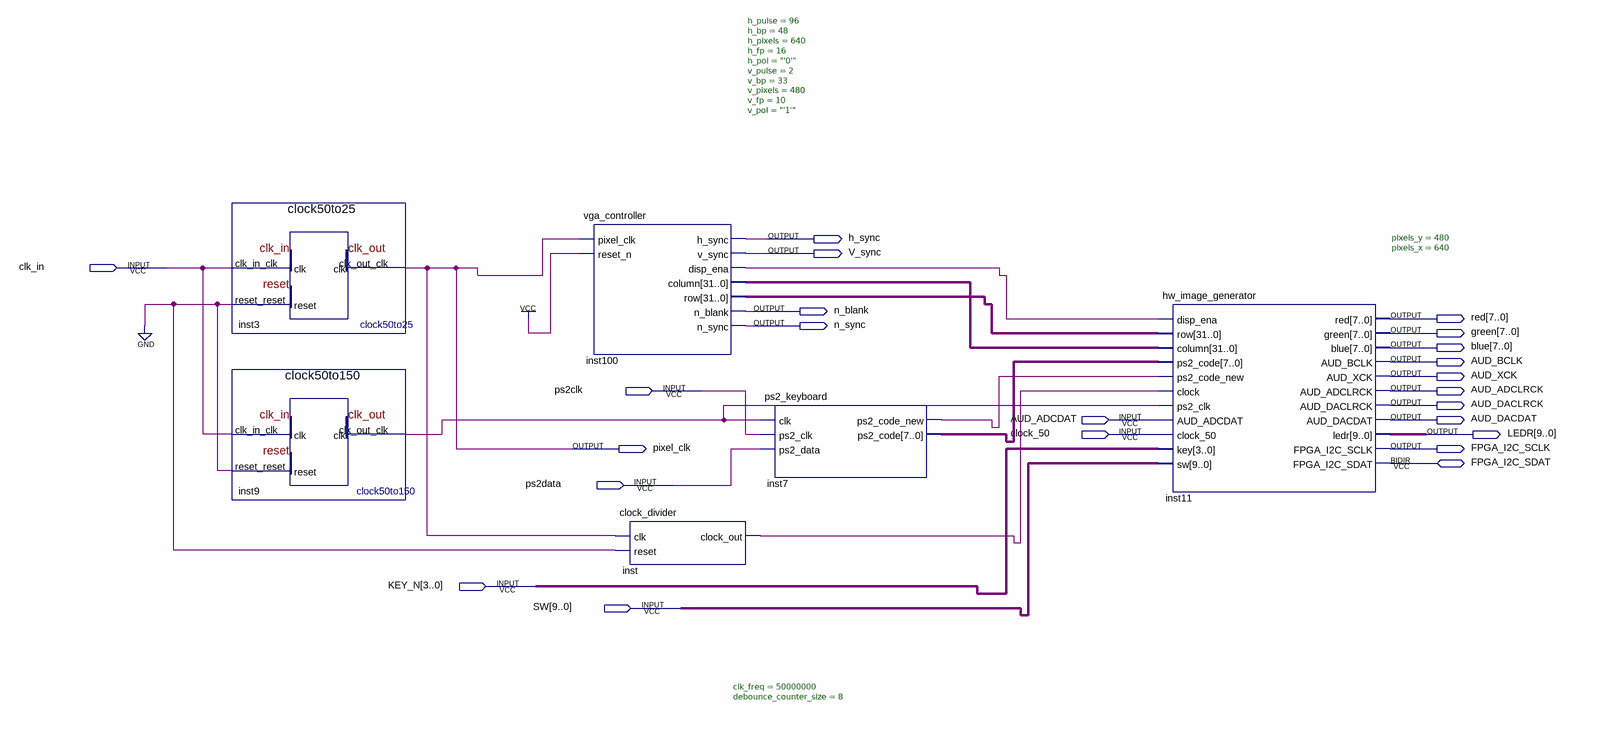
[diagram p0: schematic sheet]
// Quartus schematic snake.bdf as structural Verilog: 6 symbols, 23 pins
module snake (
  input  clk_in,
  input  ps2clk,
  input  AUD_ADCDAT,
  input  clock_50,
  input  ps2data,
  input  [3:0] KEY_N,
  input  [9:0] SW,
  inout  FPGA_I2C_SDAT,
  output h_sync,
  output V_sync,
  output n_blank,
  output [7:0] red,
  output n_sync,
  output [7:0] green,
  output [7:0] blue,
  output AUD_BCLK,
  output AUD_XCK,
  output AUD_ADCLRCK,
  output AUD_DACLRCK,
  output AUD_DACDAT,
  output [9:0] LEDR,
  output pixel_clk,
  output FPGA_I2C_SCLK
);

  wire inst7_ps2_code_new, inst9_clk_out_clk, inst100_disp_ena, inst_clock_out;
  wire [7:0] inst7_ps2_code;
  wire [31:0] inst100_column, inst100_row;

  clock50to25 inst3 (.clk_in_clk(clk_in), .reset_reset(1'b0), .clk_out_clk(pixel_clk));
  clock50to150 inst9 (.clk_in_clk(clk_in), .reset_reset(1'b0), .clk_out_clk(inst9_clk_out_clk));
  vga_controller #(.h_pulse(96), .h_bp(48), .h_pixels(640), .h_fp(16), .h_pol("'0'"), .v_pulse(2), .v_bp(33), .v_pixels(480), .v_fp(10), .v_pol("'1'")) inst100 (
    .pixel_clk(pixel_clk), .reset_n(1'b1), .h_sync(h_sync), .v_sync(V_sync), .disp_ena(inst100_disp_ena),
    .column(inst100_column), .row(inst100_row), .n_blank(n_blank), .n_sync(n_sync));
  clock_divider inst (.clk(pixel_clk), .reset(1'b0), .clock_out(inst_clock_out));
  ps2_keyboard #(.clk_freq(50000000), .debounce_counter_size(8)) inst7 (
    .clk(inst9_clk_out_clk), .ps2_clk(ps2clk), .ps2_data(ps2data), .ps2_code_new(inst7_ps2_code_new),
    .ps2_code(inst7_ps2_code));
  hw_image_generator #(.pixels_y(480), .pixels_x(640)) inst11 (
    .disp_ena(inst100_disp_ena), .row(inst100_row), .column(inst100_column), .ps2_code(inst7_ps2_code),
    .ps2_code_new(inst7_ps2_code_new), .clock(inst_clock_out), .ps2_clk(inst9_clk_out_clk),
    .AUD_ADCDAT(AUD_ADCDAT), .clock_50(clock_50), .key(KEY_N), .sw(SW), .red(red), .green(green),
    .blue(blue), .AUD_BCLK(AUD_BCLK), .AUD_XCK(AUD_XCK), .AUD_ADCLRCK(AUD_ADCLRCK),
    .AUD_DACLRCK(AUD_DACLRCK), .AUD_DACDAT(AUD_DACDAT), .ledr(LEDR), .FPGA_I2C_SCLK(FPGA_I2C_SCLK),
    .FPGA_I2C_SDAT(FPGA_I2C_SDAT));
endmodule
